# Altium project XPCAM-C_1V4.PrjPCB
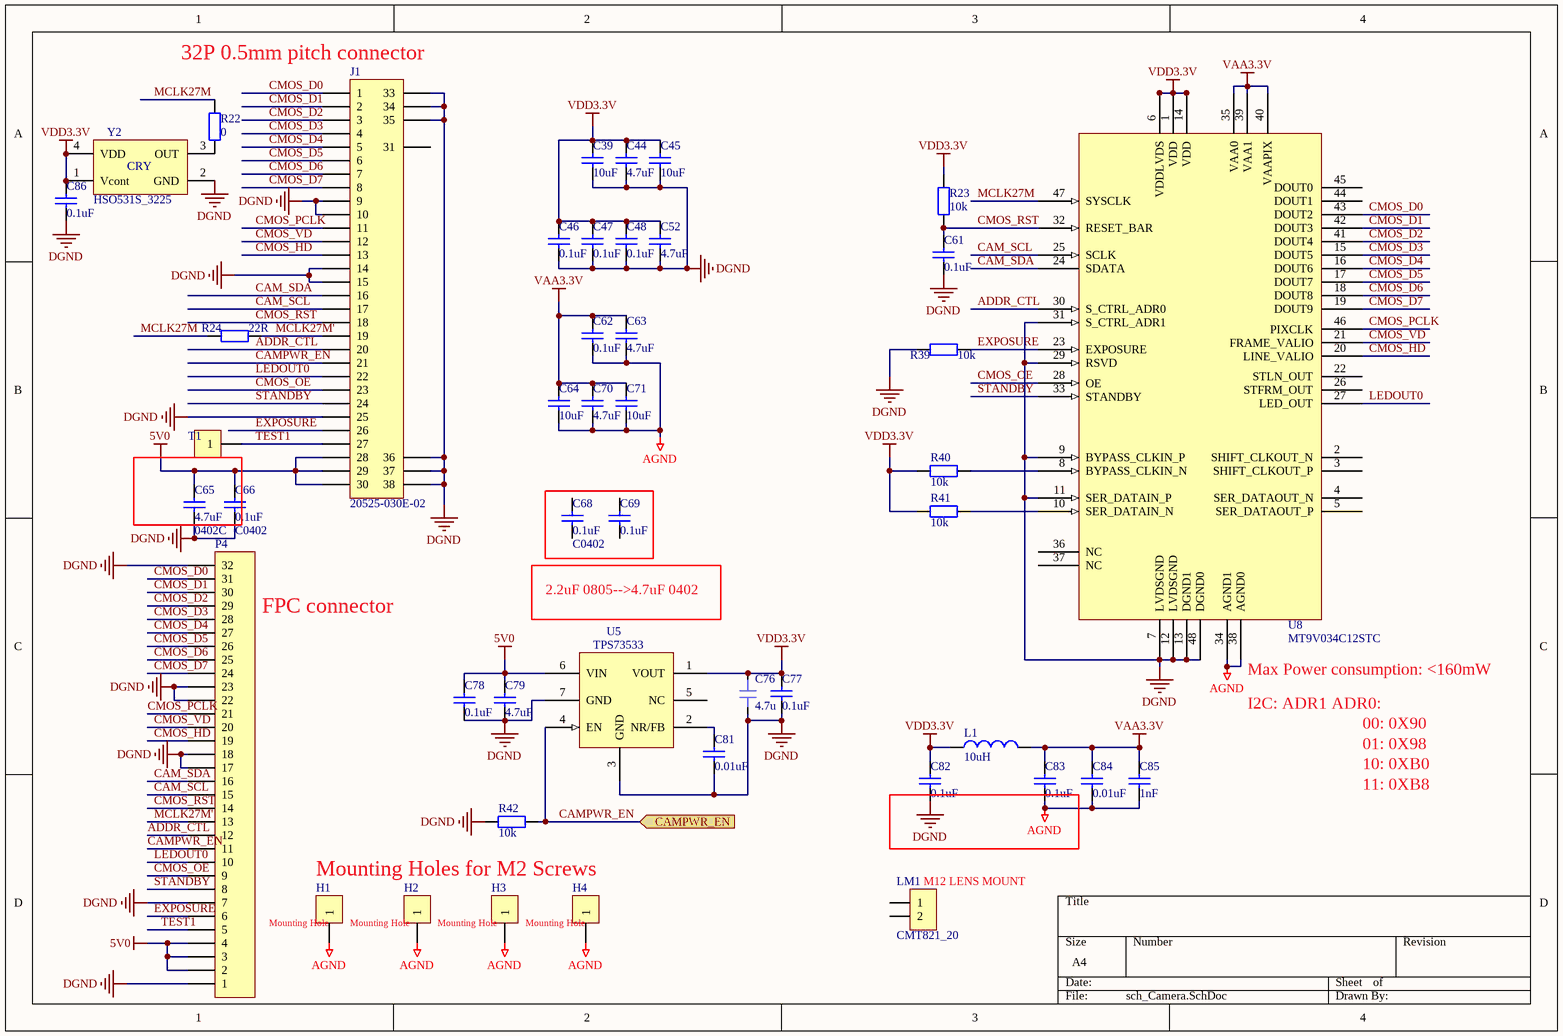
[diagram p0: sch_Camera.SchDoc]
1 sheet, 46 parts. Net scope: flat (ports and power ports of the same name join across sheets).

## Sheet sch_Camera.SchDoc
size A4

### Parts
C39  10uF  [0805C]
C44  4.7uF  [0402C]
C45  10uF  [0805C]
C46  0.1uF  [0402C]
C47  0.1uF  [0402C]
C48  0.1uF  [0402C]
C52  4.7uF  [0402C]
C61  0.1uF  [0402C]
C62  0.1uF  [0402C]
C63  4.7uF  [0402C]
C64  10uF  [0805C]
C65  4.7uF  value 0402C  [0402C]
C66  0.1uF  value C0402  [0402C]
C68  0.1uF  value C0402  [0402C]
C69  0.1uF  [0402C]
C70  4.7uF  [0402C]
C71  10uF  [0805C]
C76  4.7u  [0402C_L]
C77  0.1uF  [0402C_L]
C78  0.1uF  [0402C]
C79  4.7uF  [0402C_L]
C81  0.01uF  [0402C_L]
C82  0.1uF  [0402C_L]
C83  0.1uF  [0402C_L]
C84  0.01uF  [0402C_L]
C85  1nF  [0402C_L]
C86  0.1uF  [0402C]
H1  CON1  [PAD_M3_D350_450]  (value not drawn)
H2  CON1  [PAD_M3_D350_450]  (value not drawn)
H3  CON1  [PAD_M3_D350_450]  (value not drawn)
H4  CON1  [PAD_M3_D350_450]  (value not drawn)
J1  20525-030E-02  [HSA30_P40L196W42H10_20525]
L1  10uH  [0805R]
LM1  CMT821_20  [PAD_M3_D350_450]
P4  Header_32  [HS32A_FPC_P50L2350W480H210]  (value not drawn)
R22  value 0  [0402R]  (hidden comment: 0R)
R23  10K  [0402R]
R24  22R  [0402R]
R39  10K  [0402R]
R40  10K  [0402R]
R41  10K  [0402R]
R42  10K  [0402R_L]
T1  CON1  [PAD_TP_D1.2]  (value not drawn)
U5  TPS73533  [SON6_P65L21W21H8_DRV]
U8  MT9V034C12STC  [CLCC48_P80L114W114H23]
Y2  HSO531S_3225  [XTAL_3225]

### Ports
CAMPWR_EN (in)

### Nets
5V0: C65.2 C66.2 C78.2 C79.2 J1.28 J1.29 J1.30 P4.2 P4.3 P4.4 U5.6(VIN)
AGND: C62.1 C63.1 C64.1 C70.1 C71.1 C83.1 C84.1 C85.1 H1.1 H2.1 H3.1 H4.1 U8.34(AGND1) U8.38(AGND0)
DGND: C39.1 C44.1 C45.1 C46.1 C47.1 C48.1 C52.1 C61.1 C65.1 C66.1 C76.2 C77.1 C78.1 C79.1 C81.1 C82.1 C86.1 J1.9 J1.10 J1.14 J1.15 J1.25 J1.33 J1.34 J1.35 J1.36 J1.37 J1.38 P4.1 P4.7 P4.17 P4.18 P4.22 P4.23 P4.32 R39.2 R42.1 U5.3(GND) U5.7(GND) U8.7(LVDSGND) U8.9(BYPASS_CLKIN_P) U8.11(SER_DATAIN_P) U8.12(LVDSGND) U8.13(DGND1) U8.29(RSVD) U8.31(S_CTRL_ADR1) U8.48(DGND0) Y2.2(GND)
VAA3.3V: C62.2 C63.2 C64.2 C70.2 C71.2 C83.2 C84.2 C85.2 L1.2 U8.35(VAA0) U8.39(VAA1) U8.40(VAAPIX)
VDD3.3V: C39.2 C44.2 C45.2 C46.2 C47.2 C48.2 C52.2 C76.1 C77.2 C82.2 C86.2 L1.1 R23.2 R40.2 R41.2 U5.1(VOUT) U8.1(VDD) U8.6(VDDLVDS) U8.14(VDD) Y2.1(Vcont) Y2.4(VDD)
ADDR_CTL: J1.20 P4.12 U8.30(S_CTRL_ADR0)
CAM_SCL: J1.17 P4.15 U8.25(SCLK)
CAM_SDA: J1.16 P4.16 U8.24(SDATA)
CAMPWR_EN: J1.21 P4.11 R42.2 U5.4(EN) ; port CAMPWR_EN
CMOS_D0: J1.1 P4.31 U8.43(DOUT2)
CMOS_D1: J1.2 P4.30 U8.42(DOUT3)
CMOS_D2: J1.3 P4.29 U8.41(DOUT4)
CMOS_D3: J1.4 P4.28 U8.15(DOUT5)
CMOS_D4: J1.5 P4.27 U8.16(DOUT6)
CMOS_D5: J1.6 P4.26 U8.17(DOUT7)
CMOS_D6: J1.7 P4.25 U8.18(DOUT8)
CMOS_D7: J1.8 P4.24 U8.19(DOUT9)
CMOS_HD: J1.13 P4.19 U8.20(LINE_VALIO)
CMOS_OE: J1.23 P4.9 U8.28(OE)
CMOS_PCLK: J1.11 P4.21 U8.46(PIXCLK)
CMOS_RST: C61.2 J1.18 P4.14 R23.1 U8.32(RESET_BAR)
CMOS_VD: J1.12 P4.20 U8.21(FRAME_VALIO)
EXPOSURE: J1.26 P4.6 R39.1 U8.23(EXPOSURE)
LEDOUT0: J1.22 P4.10 U8.27(LED_OUT)
MCLK27M: R22.1 R24.1 U8.47(SYSCLK)
MCLK27M': J1.19 P4.13 R24.2
STANDBY: J1.24 P4.8 U8.33(STANDBY)
TEST1: J1.27 P4.5 T1.1
NetC81_2: C81.2 U5.2(NR/FB)
NetR22_2: R22.2 Y2.3(OUT)
NetR40_1: R40.1 U8.8(BYPASS_CLKIN_N)
NetR41_1: R41.1 U8.10(SER_DATAIN_N)

Not connected (* = marked no-connect by the designer): C68 1 2; C69 1 2; J1 31; LM1 1 2; U5 5(NC); U8 2(SHIFT_CLKOUT_N) 3(SHIFT_CLKOUT_P) 4(SER_DATAOUT_N) 5(SER_DATAOUT_P) 22(STLN_OUT) 26(STFRM_OUT) 36(NC) 37(NC) 44(DOUT1) 45(DOUT0)

### Notes on the sheet
- (near J1) 32P 0.5mm pitch connector
- (near P4) FPC connector
- 2.2uF 0805-->4.7uF 0402
- (near U8) Max Power consumption: <160mW
- I2C: ADR1 ADR0:
- 00: 0X90
- 01: 0X98
- 10: 0XB0
- 11: 0XB8
- (near H1) Mounting Hole
- Mounting Holes for M2 Screws
- (near H2) Mounting Hole
- (near H3) Mounting Hole
- (near H4) Mounting Hole
- (near LM1) M12 LENS MOUNT

### Library data of the parts
C39 C44-C48 C52 C61-C66 C68-C71 C77-C79 C81-C86 = Cap: Capacitor; Published: 8-Jun-2000; LatestRevisionDate: 17-Jul-2002; LatestRevisionNote: Re-released for DXP Platform.; Publisher: Altium Limited
  C39 C45 C64 C71: PackageReference: RAD-0.3; Value: 10uF
  C44 C52 C63 C70 C79: PackageReference: RAD-0.3; Value: 4.7uF
  C46-C48 C61 C62 C69 C77 C78 C82 C83 C86: Value: 0.1uF
  C65: PackageReference: RAD-0.3
  C81: PackageReference: RAD-0.3; Value: 0.01uF
  C84: Value: 0.01uF
  C85: Value: 1nF
C76 = cap0402: CC0402MRX5R5BB475; 元件类别: 贴片电容; 主物料厂家: YAGEO
H1-H4 T1 = CON1: Connector
L1 = Inductor: Value: 330mH
LM1 = CON2: Connector
P4 = Header 30X2: Header, 30-Pin, Dual row; LatestRevisionDate: 17-Jul-2002; LatestRevisionNote: Re-released for DXP Platform.; Publisher: Altium Limited
R22-R24 R39-R42 = Resistor: Published: 8-Jun-2000; LatestRevisionDate: 17-Jul-2002; LatestRevisionNote: Re-released for DXP Platform.; PackageReference: AXIAL-0.4; Publisher: Altium Limited
  R23 R39-R42: Value: 10k
  R24: Value: 22R
U8 = MT9V034
Y2 = CRY: 有源晶振